# Altium project ZLS-007.PrjPcb
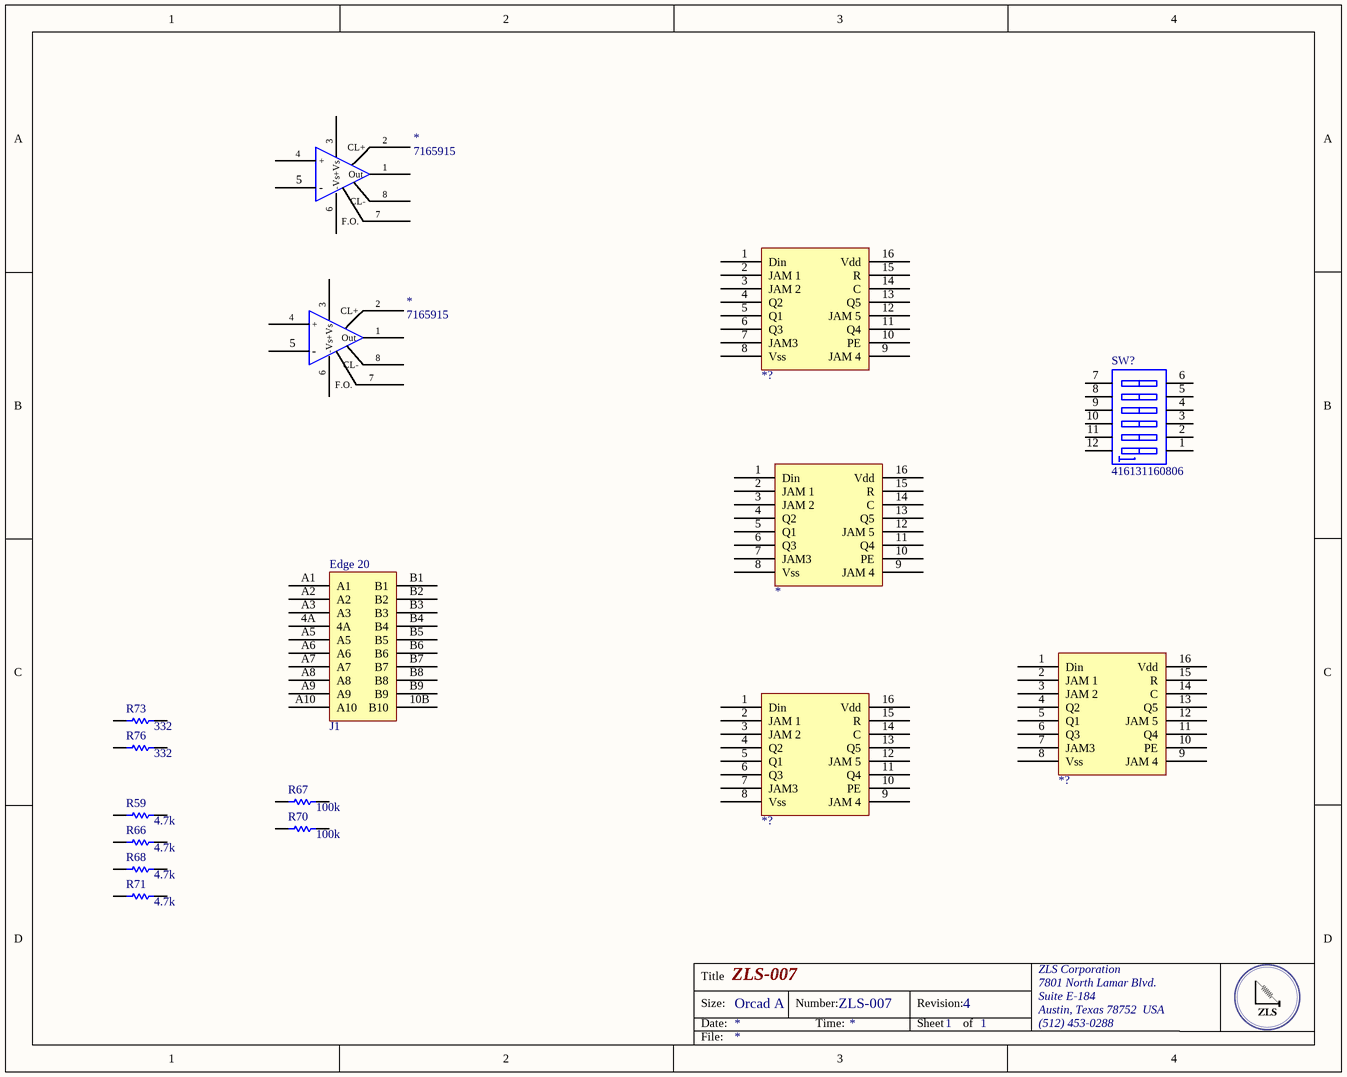
[diagram p0: ZLS-007.SchDoc]
1 sheet, 16 parts. Net scope: global (net labels, ports and power ports of the same name join across sheets).
Board file: zls-007.PcbDoc

## Sheet ZLS-007.SchDoc: ZLS-007
size OrCAD A; DocumentNumber: ZLS-007; Revision: 4; SheetNumber: 1; SheetTotal: 1; ProjectName: 200Hz Board

### Parts
(Parts that share a designator on the sheet are numbered #1, #2 ... from top to bottom, then left to right.)
*#1  Supplier Part Number 1: 7165915  [TO-3-8]  (hidden comment: PA12)
*#2  Supplier Part Number 1: 7165915  [TO-3-8]  (hidden comment: PA12)
*#3  MC14018B  [SOIC127P600X175-16N]  (value not drawn)
*?#1  MC14018B  [SOIC127P600X175-16N]  (value not drawn)
*?#2  MC14018B  [SOIC127P600X175-16N]  (value not drawn)
*?#3  MC14018B  [SOIC127P600X175-16N]  (value not drawn)
J1  Edge 20  [Edge Connector 20]
R59  Resistance (Ohms): 4.7k  [RESC1206(3216)_L]  (hidden comment: RES SMD 4.7K OHM 1% 1/4W 1206)
R66  Resistance (Ohms): 4.7k  [RESC1206(3216)_L]  (hidden comment: RES SMD 4.7K OHM 1% 1/4W 1206)
R67  Resistance (Ohms): 100k  [RESC1206(3216)_L]  (hidden comment: RES SMD 100K OHM 1% 1/4W 1206)
R68  Resistance (Ohms): 4.7k  [RESC1206(3216)_L]  (hidden comment: RES SMD 4.7K OHM 1% 1/4W 1206)
R70  Resistance (Ohms): 100k  [RESC1206(3216)_L]  (hidden comment: RES SMD 100K OHM 1% 1/4W 1206)
R71  Resistance (Ohms): 4.7k  [RESC1206(3216)_L]  (hidden comment: RES SMD 4.7K OHM 1% 1/4W 1206)
R73  Resistance (Ohms): 332  [RESC1206(3216)_L]  (hidden comment: RES SMD 332 OHM 1% 1/4W 1206)
R76  Resistance (Ohms): 332  [RESC1206(3216)_L]  (hidden comment: RES SMD 332 OHM 1% 1/4W 1206)
SW?  416131160806  [416131160806]

### Nets

Not connected (* = marked no-connect by the designer): *#1 1(Out) 2(CL+) 3(+Vs) 4(+) 5(-) 6(-Vs) 7(F.O.) 8(CL-); *#2 1(Out) 2(CL+) 3(+Vs) 4(+) 5(-) 6(-Vs) 7(F.O.) 8(CL-); *#3 1(Din) 2(JAM_1) 3(JAM_2) 4(Q2) 5(Q1) 6(Q3) 7(JAM3) 8(Vss) 9(JAM_4) 10(PE) 11(Q4) 12(JAM_5) 13(Q5) 14(C) 15(R) 16(Vdd); *?#1 1(Din) 2(JAM_1) 3(JAM_2) 4(Q2) 5(Q1) 6(Q3) 7(JAM3) 8(Vss) 9(JAM_4) 10(PE) 11(Q4) 12(JAM_5) 13(Q5) 14(C) 15(R) 16(Vdd); *?#2 1(Din) 2(JAM_1) 3(JAM_2) 4(Q2) 5(Q1) 6(Q3) 7(JAM3) 8(Vss) 9(JAM_4) 10(PE) 11(Q4) 12(JAM_5) 13(Q5) 14(C) 15(R) 16(Vdd); *?#3 1(Din) 2(JAM_1) 3(JAM_2) 4(Q2) 5(Q1) 6(Q3) 7(JAM3) 8(Vss) 9(JAM_4) 10(PE) 11(Q4) 12(JAM_5) 13(Q5) 14(C) 15(R) 16(Vdd); J1 4A 10B(B10) A1 A2 A3 A5 A6 A7 A8 A9 A10 B1 B2 B3 B4 B5 B6 B7 B8 B9; R59 1 2; R66 1 2; R67 1 2; R68 1 2; R70 1 2; R71 1 2; R73 1 2; R76 1 2; SW? 1 2 3 4 5 6 7 8 9 10 11 12

### Notes on the sheet
- Title
- Size:
- Date:
- Orcad A
- Number:
- Time:
- Revision:
- Sheet
- of
- ZLS Corporation
- 7801 North Lamar Blvd.
- Suite E-184
- Austin, Texas 78752  USA
- (512) 453-0288
- File:

### Library data of the parts
R59 R66 R68 R71 = CMP-1014-00659-1: Manufacturer: Vishay Dale; Manufacturer Part Number: CRCW12064K70FKEA; Power (Watts): 0.25W, 1/4W; Temperature Coefficient: ±100ppm/K; Supplier 1: Digi-Key; Supplier Part Number 1: 541-4.70KFCT-ND; RoHS: RoHS Compliant; Description: RES SMD 4.7K OHM 1% 1/4W 1206; Category: Resistors; Stock 1: 18; Pricing 1: 1=0.1, 10=0.062, 100=0.0254, 1000=0.0114, 2500=0.00989 (USD); Packaging: Cut Tape (CT); Part Status: Active; Tolerance: ±1%; Composition: Thick Film; Features: Automotive AEC-Q200; Operating Temperature: -55°C ~ 155°C; Package / Case: 1206 (3216 Metric); Supplier Device Package: 1206; Size / Dimension: 0.126" L x 0.063" W (3.20mm x 1.60mm); Height - Seated (Max): 0.024" (0.60mm); Failure Rate: -; ComponentLink1URL: http://www.vishay.com/docs/20035/dcrcwe3.pdf; ComponentLink1Description: http://www.vishay.com/docs/20035/dcrcwe3.pdf
R67 R70 = CMP-1014-00659-1: Manufacturer: Vishay Dale; Manufacturer Part Number: CRCW1206100KFKEA; Power (Watts): 0.25W, 1/4W; Temperature Coefficient: ±100ppm/K; Supplier 1: Digi-Key; Supplier Part Number 1: 541-100KFCT-ND; RoHS: RoHS Compliant; Description: RES SMD 100K OHM 1% 1/4W 1206; Category: Resistors; Stock 1: 2433; Pricing 1: 1=0.1, 10=0.062, 100=0.0254, 1000=0.0114, 2500=0.00989 (USD); Packaging: Cut Tape (CT); Part Status: Active; Tolerance: ±1%; Composition: Thick Film; Features: Automotive AEC-Q200; Operating Temperature: -55°C ~ 155°C; Package / Case: 1206 (3216 Metric); Supplier Device Package: 1206; Size / Dimension: 0.126" L x 0.063" W (3.20mm x 1.60mm); Height - Seated (Max): 0.024" (0.60mm); Failure Rate: -; ComponentLink1URL: http://www.vishay.com/docs/20035/dcrcwe3.pdf; ComponentLink1Description: http://www.vishay.com/docs/20035/dcrcwe3.pdf
R73 R76 = CMP-1014-00659-1: Manufacturer: Vishay Dale; Manufacturer Part Number: CRCW1206332RFKEA; Power (Watts): 0.25W, 1/4W; Temperature Coefficient: ±100ppm/K; Supplier 1: Digi-Key; Supplier Part Number 1: 541-332FCT-ND; RoHS: RoHS Compliant; Description: RES SMD 332 OHM 1% 1/4W 1206; Category: Resistors; Stock 1: 16; Pricing 1: 1=0.1, 10=0.062, 100=0.0254, 1000=0.0114, 2500=0.00989 (USD); Packaging: Cut Tape (CT); Part Status: Active; Tolerance: ±1%; Composition: Thick Film; Features: Automotive AEC-Q200; Operating Temperature: -55°C ~ 155°C; Package / Case: 1206 (3216 Metric); Supplier Device Package: 1206; Size / Dimension: 0.126" L x 0.063" W (3.20mm x 1.60mm); Height - Seated (Max): 0.024" (0.60mm); Failure Rate: -; ComponentLink1URL: http://www.vishay.com/docs/20035/dcrcwe3.pdf; ComponentLink1Description: http://www.vishay.com/docs/20035/dcrcwe3.pdf
SW? = CMP-1433-00006-1: WS-DISV 1.27 mm small compact SMD Dip Switch with top tape; Manufacturer: Wuerth Elektronik; NoPins: 12; PackageReference: 416131160806; PartNumber: 416131160806; ComponentLink1Description: Manufacturer URL; ComponentLink2Description: Datasheet; ComponentLink2URL: http://katalog.we-online.de/em/datasheet/4161311608xx.pdf; ComponentLink1URL: http://www.we-online.com
*#1 *#2 = PA12: Supplier 1: RSComponents